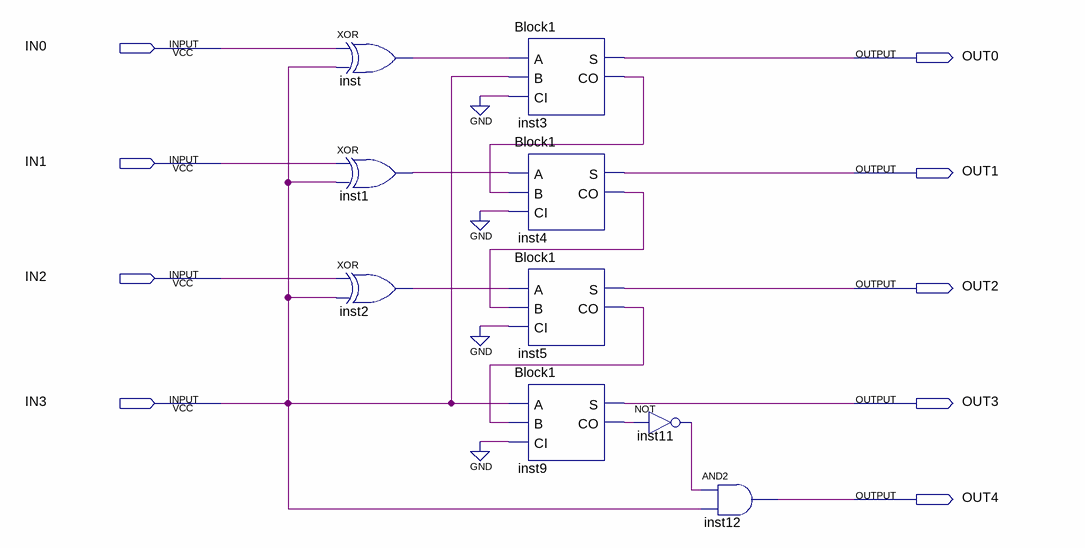
[diagram p0: schematic sheet]
// Quartus schematic Complement4.bdf as structural Verilog: 9 symbols, 9 pins
module Complement4 (
  input  IN0,
  input  IN1,
  input  IN2,
  input  IN3,
  output OUT0,
  output OUT1,
  output OUT2,
  output OUT3,
  output OUT4
);

  wire inst1_out, inst2_out, inst3_co, inst4_co, inst5_co, inst9_co, inst11_out, inst_out;

  xor inst (inst_out, IN0, IN3);
  xor inst1 (inst1_out, IN1, IN3);
  xor inst2 (inst2_out, IN2, IN3);
  Block1 inst3 (.A(inst_out), .B(IN3), .CI(1'b0), .S(OUT0), .CO(inst3_co));
  Block1 inst4 (.A(inst1_out), .B(inst3_co), .CI(1'b0), .S(OUT1), .CO(inst4_co));
  Block1 inst5 (.A(inst2_out), .B(inst4_co), .CI(1'b0), .S(OUT2), .CO(inst5_co));
  Block1 inst9 (.A(IN3), .B(inst5_co), .CI(1'b0), .S(OUT3), .CO(inst9_co));
  not inst11 (inst11_out, inst9_co);
  and inst12 (OUT4, inst11_out, IN3);
endmodule
